# Altium project KALE_MOTOR_CONTROLLER.PrjPcb
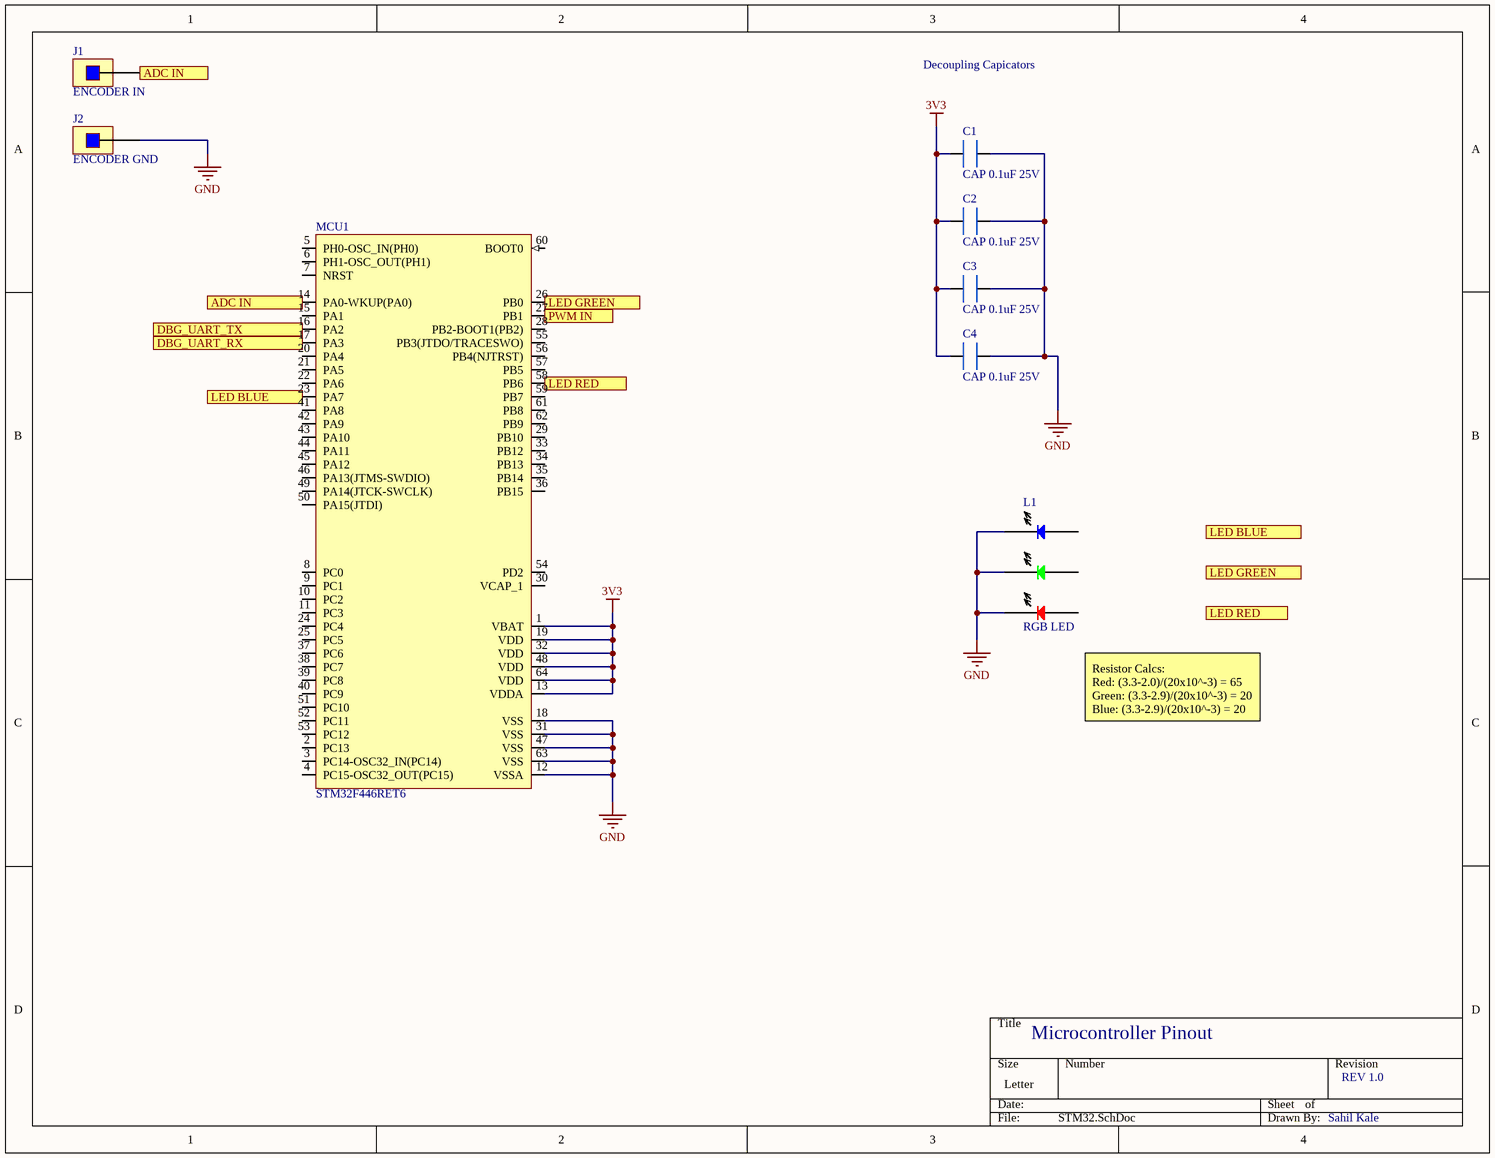
[diagram p0: STM32.SchDoc]
1 sheet, 8 parts. Net scope: flat (ports and power ports of the same name join across sheets).

## Sheet STM32.SchDoc
size Letter

### Parts
C1  CAP 0.1uF 25V
C2  CAP 0.1uF 25V
C3  CAP 0.1uF 25V
C4  CAP 0.1uF 25V
J1  ENCODER IN  [PIN_HEADER]
J2  ENCODER GND  [PIN_HEADER]
L1  RGB LED  [UHD1110-FKA-CL1A13R3Q1BBQFMF3]
MCU1  STM32F446RET6

### Ports
ADC IN, DBG_UART_RX, DBG_UART_TX, LED BLUE, LED GREEN, LED RED, PWM IN

### Nets
3V3: C1.0 C2.0 C3.0 C4.0 MCU1.1(VBAT) MCU1.13(VDDA) MCU1.19(VDD) MCU1.32(VDD) MCU1.48(VDD) MCU1.64(VDD)
GND: C1.1 C2.1 C3.1 C4.1 J2.1 L1.1(GREEN_-) L1.3(RED_-) L1.5(BLUE_-) MCU1.12(VSSA) MCU1.18(VSS) MCU1.31(VSS) MCU1.47(VSS) MCU1.63(VSS)
NetJ1_1: J1.1 MCU1.14(PA0-WKUP(PA0)) ; port ADC IN
NetMCU1_16: MCU1.16(PA2) ; port DBG_UART_TX
NetMCU1_17: MCU1.17(PA3) ; port DBG_UART_RX
NetMCU1_23: MCU1.23(PA7) ; port LED BLUE
NetMCU1_26: MCU1.26(PB0) ; port LED GREEN
NetMCU1_27: MCU1.27(PB1) ; port PWM IN
NetMCU1_58: MCU1.58(PB6) ; port LED RED

Not connected (* = marked no-connect by the designer): L1 2(Green_+) 4(Red_+) 6(Blue_+); MCU1 2(PC13) 3(PC14-OSC32_IN(PC14)) 4(PC15-OSC32_OUT(PC15)) 5(PH0-OSC_IN(PH0)) 6(PH1-OSC_OUT(PH1)) 7(NRST) 8(PC0) 9(PC1) 10(PC2) 11(PC3) 15(PA1) 20(PA4) 21(PA5) 22(PA6) 24(PC4) 25(PC5) 28(PB2-BOOT1(PB2)) 29(PB10) 30(VCAP_1) 33(PB12) 34(PB13) 35(PB14) 36(PB15) 37(PC6) 38(PC7) 39(PC8) 40(PC9) 41(PA8) 42(PA9) 43(PA10) 44(PA11) 45(PA12) 46(PA13(JTMS-SWDIO)) 49(PA14(JTCK-SWCLK)) 50(PA15(JTDI)) 51(PC10) 52(PC11) 53(PC12) 54(PD2) 55(PB3(JTDO/TRACESWO)) 56(PB4(NJTRST)) 57(PB5) 59(PB7) 60(BOOT0) 61(PB8) 62(PB9)

### Notes on the sheet
- Decoupling Capicators
- (near L1) Resistor Calcs:
  Red: (3.3-2.0)/(20x10^-3) = 65
  Green: (3.3-2.9)/(20x10^-3) = 20
  Blue: (3.3-2.9)/(20x10^-3) = 20
- Microcontroller Pinout
- REV 1.0
- Sahil Kale

### Library data of the parts
C1-C4 = CAP 0.1uF 25V: Tantalum Capacitor, Polarized, Tantalum (dry/solid), 25V, 20% +Tol, 20% -Tol, 0.1uF, Surface Mount, 0805; Manufacturer: Vishay; Manufacturer Part Number: TMCP1E104MTRF; Supplier 1: Digi-Key; RoHS: No; Category: Tantalum Capacitors; Stock 1: 2857; Pricing 1: 1=0.33000, 10=0.22600, 50=0.15800, 100=0.13550, 500=0.10158, 1000=0.08579 (USD); Number of Pins: 2; Dielectric Material: Tantalum; Terminal Finish: Tin; JESD-609 Code: e3; Capacitor Type: Tantalum; ComponentLink1URL: https://datasheet.ciiva.com:443/pdfs/VipMasterIC/IC/VISH/VISH-S-A0002931701/VISH-S-A0002931701-1.pdf?src-supplier=IHS+Markit; ComponentLink1Description: https://datasheet.ciiva.com:443/pdfs/VipMasterIC/IC/VISH/VISH-S-A0002931701/VISH-S-A0002931701-1.pdf?src-supplier=IHS+Markit; Supplier Part Number 1: 718-2505-1-ND
J1 J2 = PIN_HEADER: Board Connector, 1 Contact(s), 1 Row(s), Male, Straight, Solder Terminal; Manufacturer: Sullins; Manufacturer Part Number: PREC001SAAN-RC; Option: General Purpose; Filter Feature: No; Number of Rows Loaded: 1; Supplier 1: Digi-Key; RoHS: Yes; Category: Connectors; Stock 1: 16681; Pricing 1: 1=0.04000, 10=0.03000, 25=0.02800, 50=0.02080, 100=0.01780, 250=0.01724, 500=0.01486 (USD); Mount: Board; Connector Type: BOARD CONNECTOR; Contact Gender: Male; Mixed Contacts: No; Mounting Style: STRAIGHT; Termination: Solder; Number of Contacts: 1; Flammability Rating: UL94 V-0; DIN Conformance: No; IEC Conformance: No; MIL Conformance: No; ComponentLink1URL: https://datasheet.ciiva.com:443/pdfs/VipMasterIC/IC/SUCS/SUCS-S-A0005121173/SUCS-S-A0005121173-1.pdf?src-supplier=IHS+Markit; ComponentLink1Description: https://datasheet.ciiva.com:443/pdfs/VipMasterIC/IC/SUCS/SUCS-S-A0005121173/SUCS-S-A0005121173-1.pdf?src-supplier=IHS+Markit; ComponentLink2URL: https://datasheet.ciiva.com/740/zrzczzzszzn-rc-st-11635-b-740844.pdf?src-supplier=Digi-Key; ComponentLink2Description: https://datasheet.ciiva.com/740/zrzczzzszzn-rc-st-11635-b-740844.pdf?src-supplier=Digi-Key; Supplier Part Number 1: S1012EC-01-ND
L1 = LED_RGB: Triple Color LED
MCU1 = STM32F446RET6: Parameter 1: *